# EAGLE design strobe_3 (EAGLE 7.0.0)
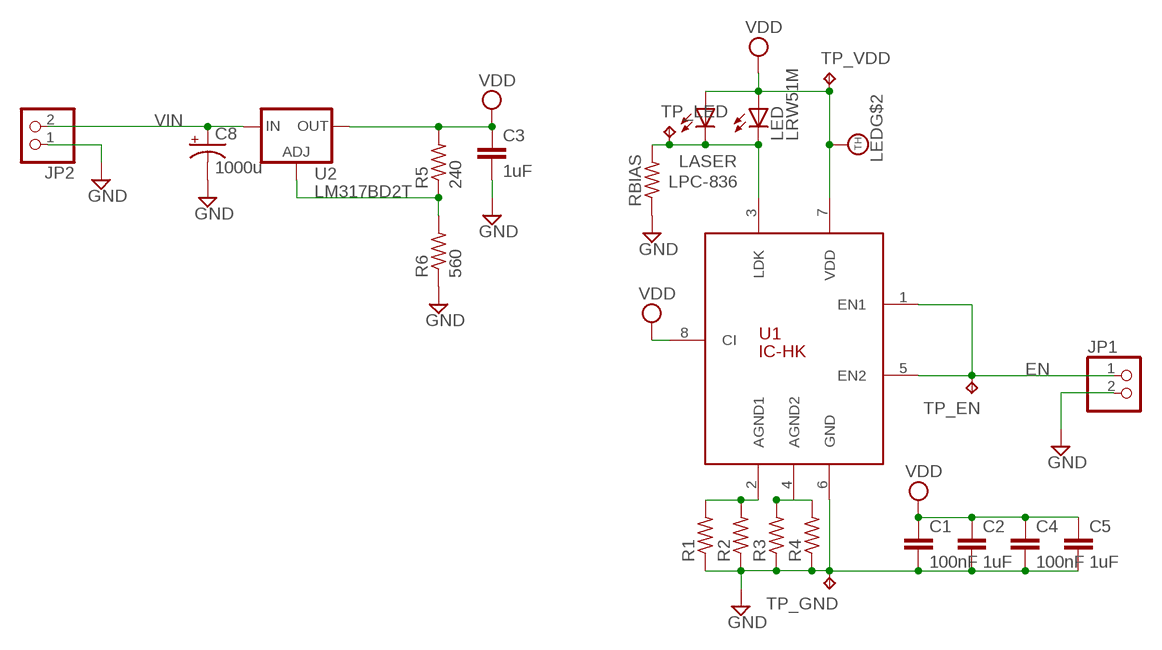
[diagram p0: schematic, sheet 1]

## Parts
C1  100nF  C-EUC0805  [C0805]
C2  1uF  C-EUC0805  [C0805]
C3  1uF  C-EUC0805  [C0805]
C4  100nF  C-EUC0805  [C0805]
C5  1uF  C-EUC0805  [C0805]
C8  1000u  CPOL-USE5-10.5  [E5-10,5]
JP1  PINHD-1X2  [1X02]
JP2  PINHD-1X2  [1X02]
LASER  LPC-836  [LASER-TO18]
LED  LRW51M  [W51]
R1  R-US_R1206  [R1206]
R2  R-US_R1206  [R1206]
R3  R-US_R1206  [R1206]
R4  R-US_R1206  [R1206]
R5  240  R-US_R1206  [R1206]
R6  560  R-US_R1206  [R1206]
RBIAS  R-US_R1206  [R1206]
TP_EN  TPPAD1-17  [P1-17]
TP_GND  TPPAD1-17  [P1-17]
TP_LED  TPPAD1-17  [P1-17]
TP_VDD  TPPAD1-17  [P1-17]
U1  IC-HK  [SO8]
U2  LM317BD2T  [D2PACK]

## Nets
EN: JP1.1 TP_EN.TP U1.1(EN1) U1.5(EN2)
GND: C1.2 C2.2 C3.2 C4.2 C5.2 C8.- JP1.2 JP2.1 R1.1 R2.1 R3.1 R4.1 R6.1 RBIAS.1 TP_GND.TP U1.6(GND)
N$1: LASER.3(C) LED.C RBIAS.2 TP_LED.TP U1.3(LDK)
N$2: R1.2 R2.2 U1.2(AGND1)
N$3: R3.2 R4.2 U1.4(AGND2)
N$7: R5.1 R6.2 U2.1(ADJ)
VDD: C1.1 C2.1 C3.1 C4.1 C5.1 LASER.1(A) LED.A LED.TH@1(TH) LED.TH@2(TH) LED.TH@3(TH) R5.2 TP_VDD.TP U1.7(VDD) U1.8(CI) U2.2(OUT)
VIN: C8.+ JP2.2 U2.3(IN)

## Library data of the parts
C1-C5 = rcl:C-EU: CAPACITOR, European symbol
C8 = rcl:CPOL-US: POLARIZED CAPACITOR, American symbol
JP1 JP2 = pinhead:PINHD-1X2: PIN HEADER
LASER = strobe:LPC-836: Cree® XLamp® XM-L LEDs Source: http://www.cree.com
LED = led:*W51M: Golden DRAGON® with Lens Enhanced Thinfilm LED Source: LA_LR_LY_W51M_Pb_free[1].pdf
R1-R6 RBIAS = rcl:R-US_: RESISTOR, American symbol
TP_EN TP_GND TP_LED TP_VDD = testpad:TP: Test pad
U1 = strobe:IC-HK: 155 MHz LASER SWITCH
U2 = v-reg:LM317?*: 500 mA Adjustable Output Positive Voltage Regulator Source: http://www.onsemi.co.jp .. LM317M-D.PDF

## Board
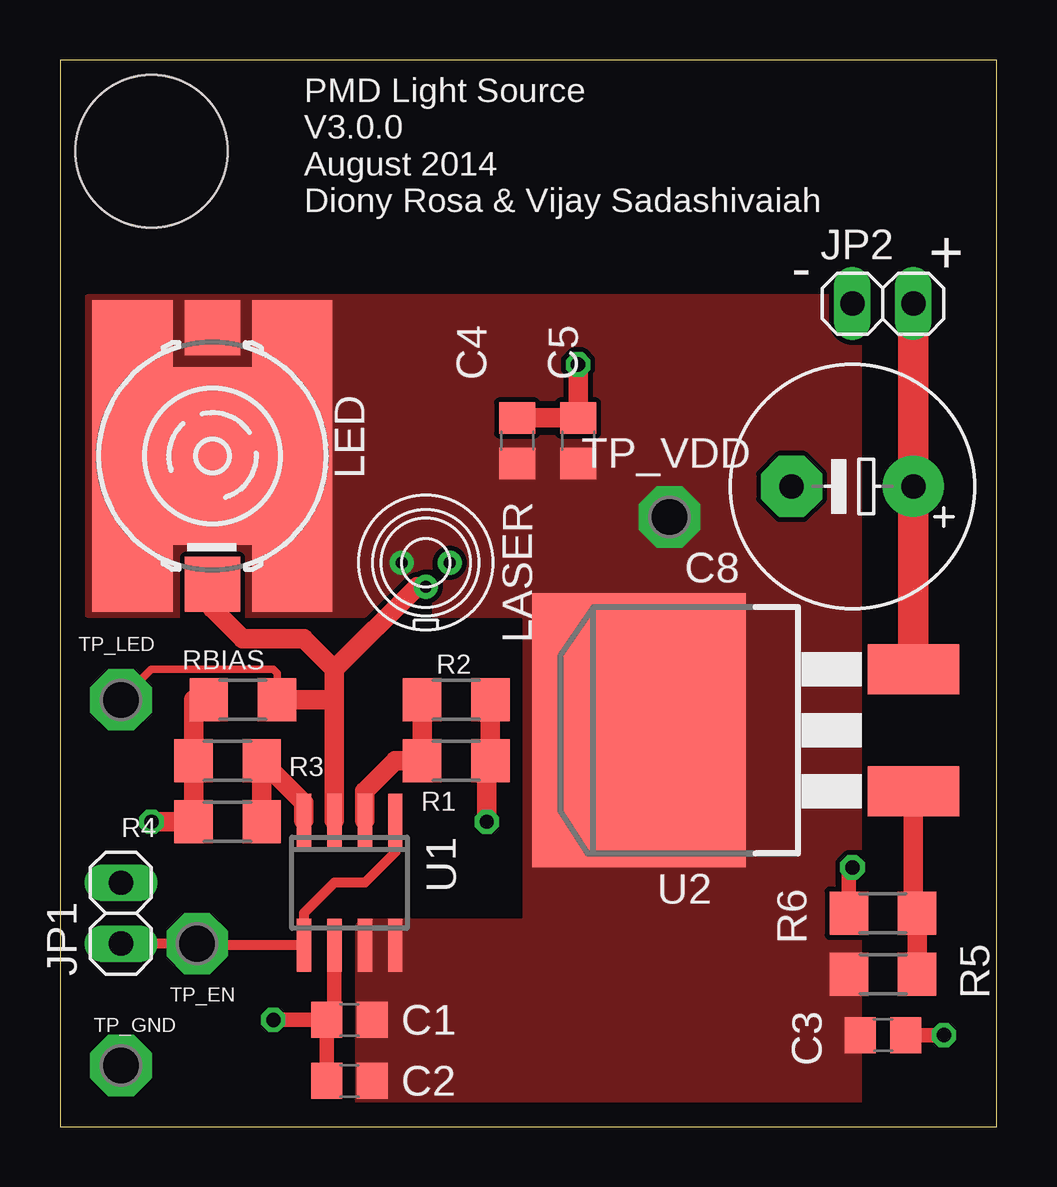
[diagram p1: board, top side]
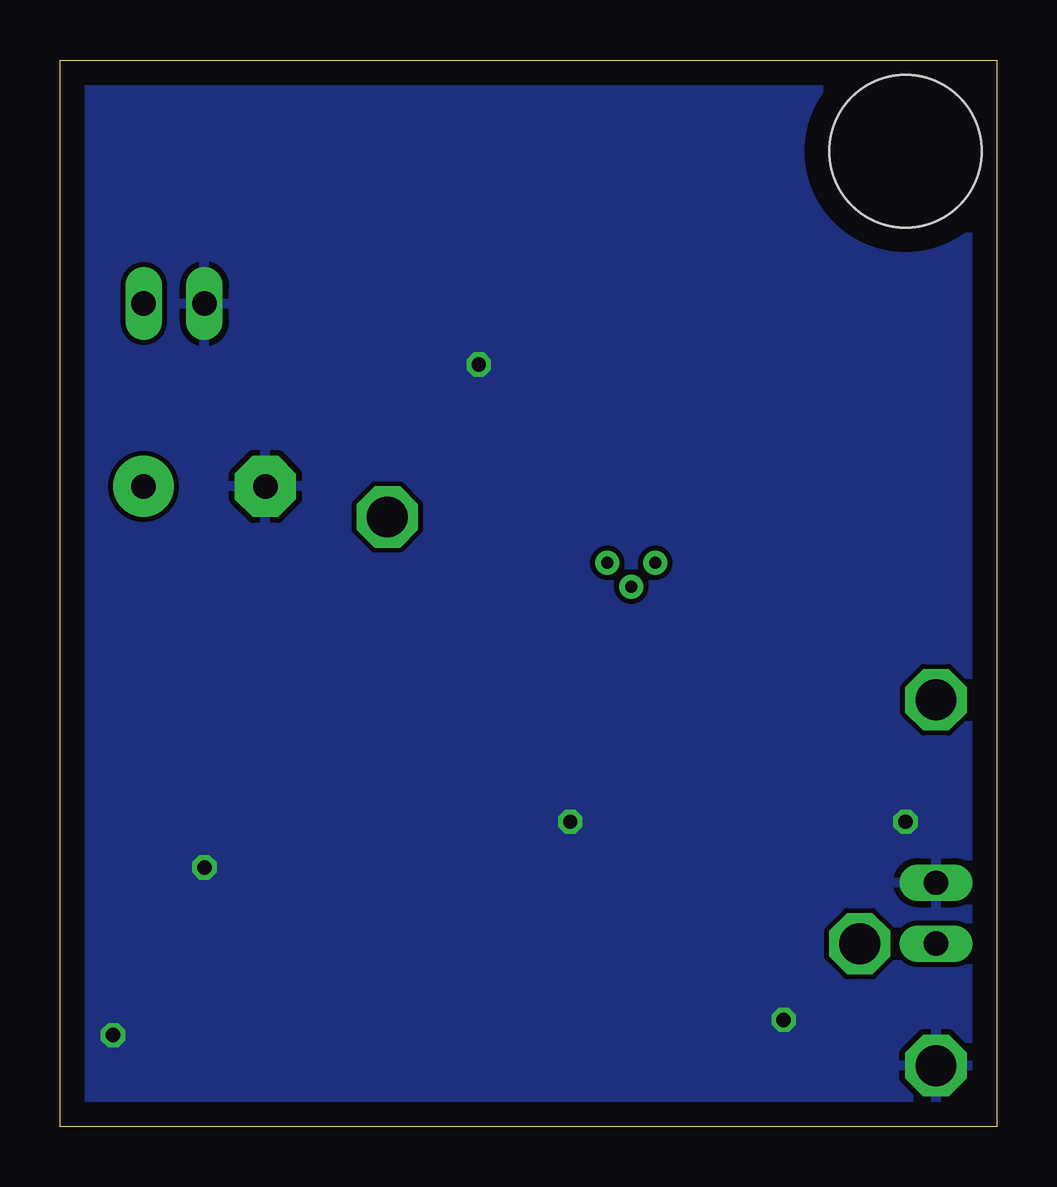
[diagram p2: board, bottom side, seen from below]

Size 39.04 x 44.44 mm. Coordinates in mm from the lower left corner, seen from the top.
Outline: 0,0 39.04,0 39.04,44.44 0,44.44 0,0
Copper layers (1*16): Top 0.035mm / dielectric 1.5mm / Bottom 0.035mm
Design rules "default": minimum track width 10mil, minimum drill 24mil, track to track 8mil, track to pad 8mil, pad to pad 8mil, via to via 8mil, smd to smd 8mil, copper to edge 40mil, drill to drill 8mil, minimum pad ring 10mil, minimum via ring 8mil, stop-mask expansion 4mil, vias tented up to drill 0mil, thermal gap 10mil
Holes 6.35 mm at 3.81,40.64

### Footprints (pad centres in the part's own frame; a part is rotated, then mirrored left to right if it is on the bottom)
C0805 = smd 1.3 x 1.5: 1 -0.95,0; 2 0.95,0
E5-10,5 = drill 1.016 pad 2.54: + -2.54,0 | drill 1.016 pad 2.54 octagon: - 2.54,0
1X02 = drill 1.016 long: 1 -1.27,0; 2 1.27,0
LASER-TO18 = drill 0.5: 1 1,0; 2 -1,0; 3 0,1
W51 = smd 2.3 x 2.3: A -5.35,0; C 5.35,0 | smd 7.4 x 3.4: TH@1 0,0 | smd 13 x 3.35: TH@2 0,3.325; TH@3 0,-3.325
R1206 = smd 1.6 x 1.803: 1 -1.422,0; 2 1.422,0
P1-17 = drill 1.702 pad 2.54 octagon: TP 0,0
SO8 = smd 0.6 x 2.2: 1 -1.905,-2.6; 2 -0.635,-2.6; 3 0.635,-2.6; 4 1.905,-2.6; 5 1.905,2.6; 6 0.635,2.6; 7 -0.635,2.6; 8 -1.905,2.6
D2PACK = smd 2.083 x 3.81: 1 -2.54,-8.89; 3 2.54,-8.89 | smd 11.43 x 8.89: 2 0,2.54

### Placement (x,y rotation side)
C1  12.06,4.45 180 top
C2  12.06,1.91 180 top
C3  34.29,3.81 0 top
C4  19.05,28.57 90 top
C5  21.59,28.57 90 top
C8  33.02,26.67 180 top
JP1  2.54,8.89 90 top
JP2  34.29,34.29 0 top
LASER  15.24,23.5 180 top
LED  6.35,27.94 270 top
R1  16.51,17.78 180 top
R2  16.51,15.24 180 top
R3  6.99,15.24 0 top
R4  6.99,12.7 0 top
R5  34.29,6.35 180 top
R6  34.29,8.89 0 top
RBIAS  7.62,17.78 0 top
TP_EN  5.71,7.62 0 top
TP_GND  2.54,2.54 0 top
TP_LED  2.54,17.78 0 top
TP_VDD  25.4,25.4 270 top
U1  12.06,10.16 180 top
U2  26.67,16.51 90 top

### Tracks (layer width: path | path; a pad name or v marks a point on that pad's centre or on a via)
EN
  Top 0.406: U1.1 13.97,11.43 12.7,10.16 11.43,10.16 10.16,8.89 U1.5 7.04,7.56 TP_EN.TP JP1.1
GND  (via drill 0.6)
  Top 0.61: C1.2 v8.89,4.45 | U1.6 11.43,4.76 C1.2 | C1.2 C2.2 | C3.2 v36.83,3.81 | R6.1 32.87,10.64 v33.02,10.79
  Top 0.813: C4.2 C5.2 v21.59,31.75 | R1.1 R2.1 17.78,15.24 v17.78,12.7 | RBIAS.1 5.56,17.78 R3.1 R4.1 v3.81,12.7
  pour Bottom: 39.37,0 39.37,44.45 0,44.45 0,0
N$1
  Top 0.305: RBIAS.2 9.04,18.9 8.89,19.05 3.81,19.05 TP_LED.TP
  Top 0.813: 11.43,17.78 U1.3 | RBIAS.2 11.43,17.78 | 11.43,17.78 11.43,19.05 | LASER.3 14.88,22.5 11.43,19.05 | LED.C 6.35,21.59 7.62,20.32 10.16,20.32 11.43,19.05
N$2
  Top 0.813: R1.2 R2.2 13.97,15.24 12.7,13.97 U1.2
N$3
  Top 0.813: R4.2 R3.2 10.16,13.49 U1.4
N$7
  Top 0.813: U2.1 35.56,9.04 R6.2 R5.1
VDD
  pour Top (no thermals): 1.27,34.29 33.02,34.29 33.02,0.64 12.7,0.64 12.7,8.26 19.68,8.26 19.68,21.59 1.27,21.59
VIN
  Top 1.27: U2.3 C8.+ JP2.2

### Text on the board
tNames: PMD Light Source / V3.0.0 / August 2014 / Diony Rosa & Vijay Sadashivaiah | + | -